# EAGLE design 1 (EAGLE 9.6.2)
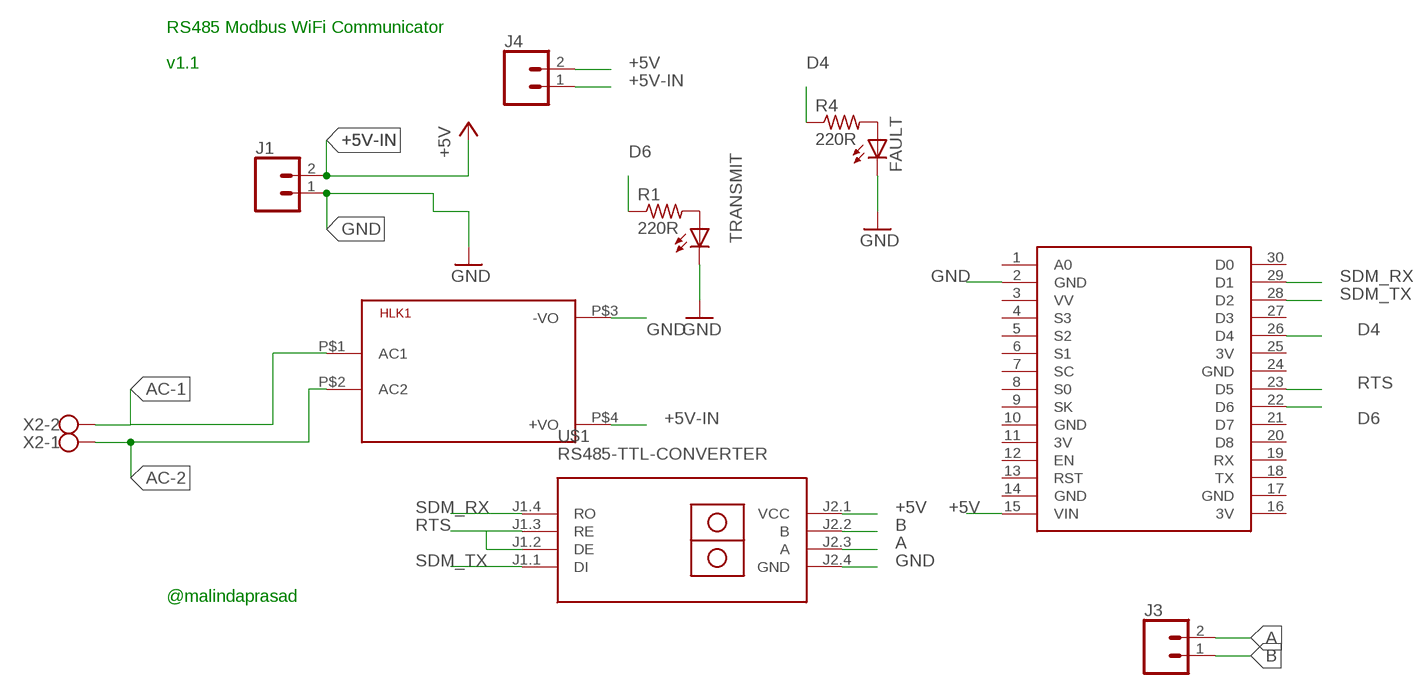
[diagram p0: schematic, sheet 1]

## Parts
FAULT  LED5MM  [LED5MM]
HLK1  HLK-PM013W  [HLK-PM01]
J1  CONN_02  [1X02]
J3  CONN_02  [1X02]
J4  CONN_02  [1X02]
R1  220R  R-US_0207/10  [0207/10]
R4  220R  R-US_0207/10  [0207/10]
TRANSMIT  LED5MM  [LED5MM]
U$1  RS485-TTL-CONVERTER  [RS485-TTL-CONVERTER]
U$2  NODEMCU  [NODEMCU]
X2  W237-102  [W237-102]

## Nets
+5V: J4.2 U$1.J2.1(VCC) U$2.15(VIN)
+5V-IN: HLK1.P$4(+VO) J1.2 J4.1 ; supply symbol labelled +5V
A: J3.2 U$1.J2.3(A)
AC-1: HLK1.P$1(AC1) X2.2
AC-2: HLK1.P$2(AC2) X2.1
B: J3.1 U$1.J2.2(B)
D4: R4.1 U$2.26(D4)
D6: R1.1 U$2.22(D6)
GND: FAULT.K(C) HLK1.P$3(-VO) J1.1 TRANSMIT.K(C) U$1.J2.4(GND) U$2.2(GND)
N$1: R1.2 TRANSMIT.A
N$5: FAULT.A R4.2
RTS: U$1.J1.2(DE) U$1.J1.3(RE) U$2.23(D5)
SDM_RX: U$1.J1.4(RO) U$2.29(D1)
SDM_TX: U$1.J1.1(DI) U$2.28(D2)
Unconnected: U$2.1(A0) U$2.3(VV) U$2.4(S3) U$2.5(S2) U$2.6(S1) U$2.7(SC) U$2.8(S0) U$2.9(SK) U$2.12(EN) U$2.13(RST) U$2.18(TX) U$2.19(RX) U$2.20(D8) U$2.21(D7) U$2.27(D3) U$2.30(D0)

## Notes on the sheet
- RS485 Modbus WiFi Communicator
- v1.1
- @malindaprasad

## Power pins joined to a net without a drawn wire
3V: U$2.11(3V) U$2.16(3V) U$2.25(3V)
GND: U$2.10(GND) U$2.14(GND) U$2.17(GND) U$2.24(GND)

## Library data of the parts
FAULT TRANSMIT = adafruit:LED: LED OSRAM: - CHIPLED LG R971, LG N971, LY N971, LG Q971, LY Q971, LO R971, LY R971 LH N974, LH R974 LS Q976, LO Q976, LY Q976 LO Q996 - Hyper CHIPLED LW Q18S LB Q993, LB Q99A, LB R99A - SideLED LS A670, LO A670, LY A670, LG A670, LP A670 LB A673, LV A673, LT A673, LW A673 LH A674 LY A675 LS A676, LA A676, LO A676, LY A676, LW A676 LS A679, LY A679, LG A679 - Hyper Micro SIDELED® LS Y876, LA Y876, LO Y876, LY Y876 LT Y87S - SmartLED LW L88C, LW L88S LB L89C, LB L89S, LG L890 LS L89K, LO L89K, LY L89K LS L896, LA L896, LO L896, LY L896 - TOPLED LS T670, LO T670, LY T670, LG T670, LP T670 LSG T670, LSP T670, LSY T670, LOP T670, LYG T670 LG T671, LOG T671, LSG T671 LB T673, LV T673, LT T673, LW T673 LH T674 LS T676, LA T676, LO T676, LY T676, LB T676, LH T676, LSB T676, LW T676 LB T67C, LV T67C, LT T67C, LS T67K, LO T67K, LY T67K, LW E67C LS E67B, LA E67B, LO E67B, LY E67B, LB E67C, LV E67C, LT E67C LW T67C LS T679, LY T679, LG T679 LS T770, LO T770, LY T770, LG T770, LP T770 LB T773, LV T773, LT T773, LW T773 LH T774 LS E675, LA E675, LY E675, LS T675 LS T776, LA T776, LO T776, LY T776, LB T776 LHGB T686 LT T68C, LB T68C - Hyper Mini TOPLED® LB M676 - Mini TOPLED Santana® LG M470 LS M47K, LO M47K, LY M47K Source: http://www.osram.convergy.de/
HLK1 = HLK-PM01:HLK-PM01: Hi-Link Power Supply HLK-PM01 3W Author: Ahmed Said <https://github.com/AhmedSaid/EAGLELibraries>
J1 J3 J4 = SparkFun-Connectors:CONN_02: Multi connection point. Often used as Generic Header-pin footprint for 0.1 inch spaced/style header connections On any of the 0.1 inch spaced packages, you can populate with these: Break Away Headers - Straight <https://www.sparkfun.com/products/116> (PRT-00116) Break Away Male Headers - Right Angle <https://www.sparkfun.com/products/553> (PRT-00553) Female Headers <https://www.sparkfun.com/products/115> (PRT-00115) Break Away Headers - Machine Pin <https://www.sparkfun.com/products/117> (PRT-00117) Break Away Female Headers - Swiss Machine Pin <https://www.sparkfun.com/products/743> (PRT-00743) For SCREWTERMINALS and SPRING TERMINALS visit here: Screw Terimnals on SparkFun.com <https://www.sparkfun.com/search/results?term=Screw+Terminals> (5mm/3.5mm/2.54mm spacing) This device is also useful as a general connection point to wire up your design to another part of your project. Our various solder wires solder well into these plated through hole pads. Hook-Up Wire - Assortment (Stranded, 22 AWG) <https://www.sparkfun.com/products/11375> (PRT-11375) Hook-Up Wire - Assortment (Solid Core, 22 AWG) <https://www.sparkfun.com/products/11367> (PRT-11367) View the entire wire category on our website here <https://www.sparkfun.com/categories/141> Special notes: Molex polarized connector foot print use with: PRT-08233 with associated crimp pins and housings. 2.54_SCREWTERM for use with PRT-10571. 3.5mm Screw Terminal footprints for PRT-08084 5mm Screw Terminal footprints for use with PRT-08432
R1 R4 = rcl:R-US_: RESISTOR, American symbol; SPICEPREFIX: R
U$1 = diy-modules:RS485-TTL-CONVERTER: RS485 to TTL converter based on MAX485 chip
U$2 = nodemcu:NODEMCU
X2 = con-wago-500:W237-102: WAGO SCREW CLAMP; MPN: 237-102; OC_FARNELL: unknown; OC_NEWARK: 70K9898

## Net classes
0 default: width 0.254 mm, drill 0.356 mm, clearance 0.254 mm

## Board
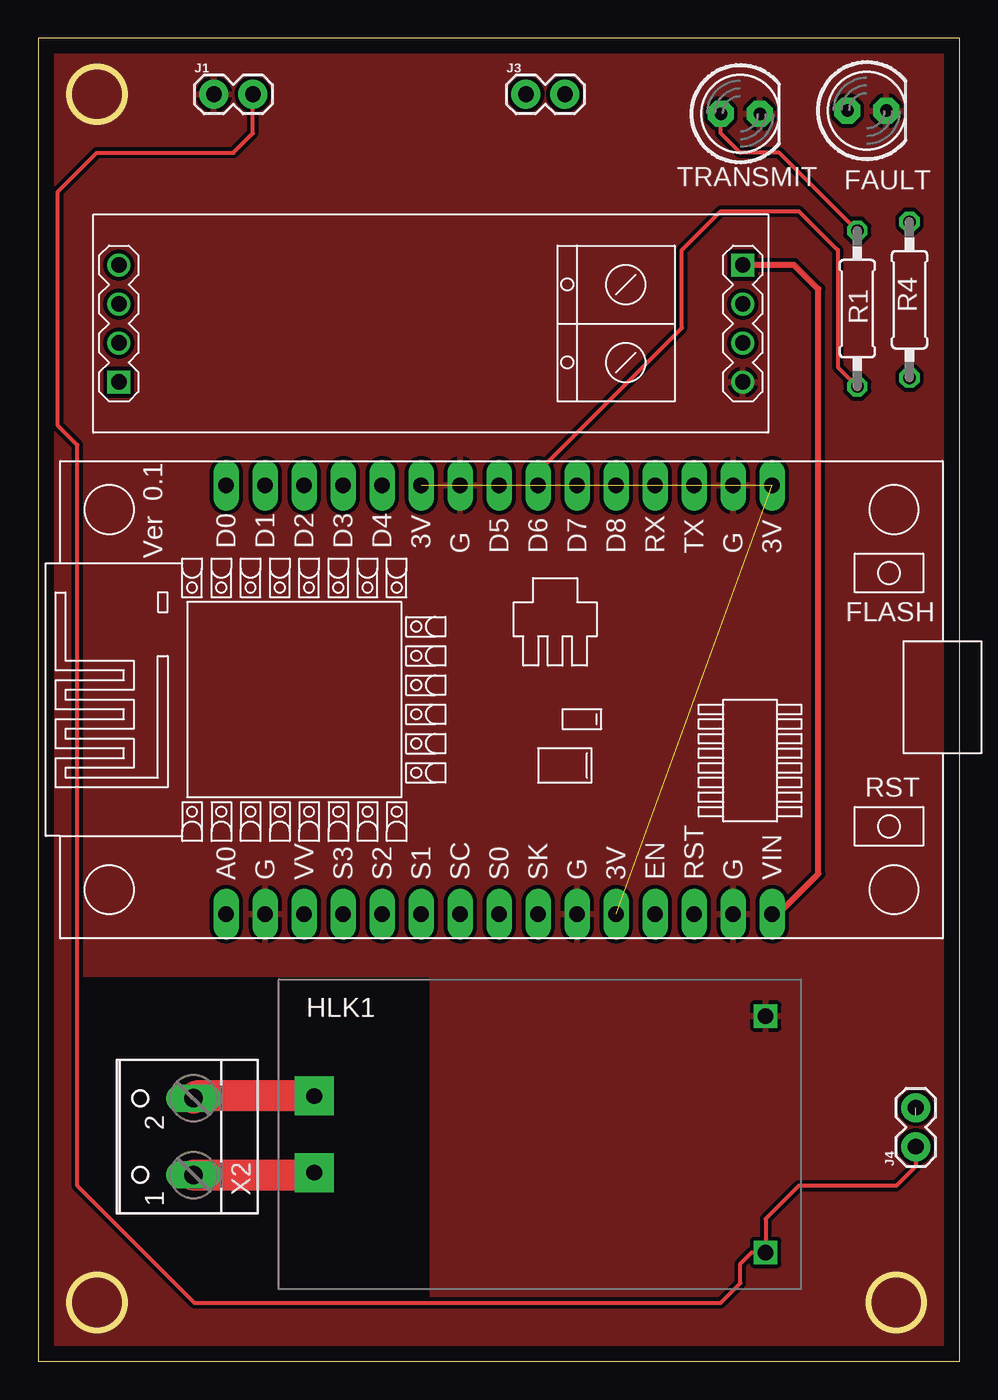
[diagram p1: board, top side]
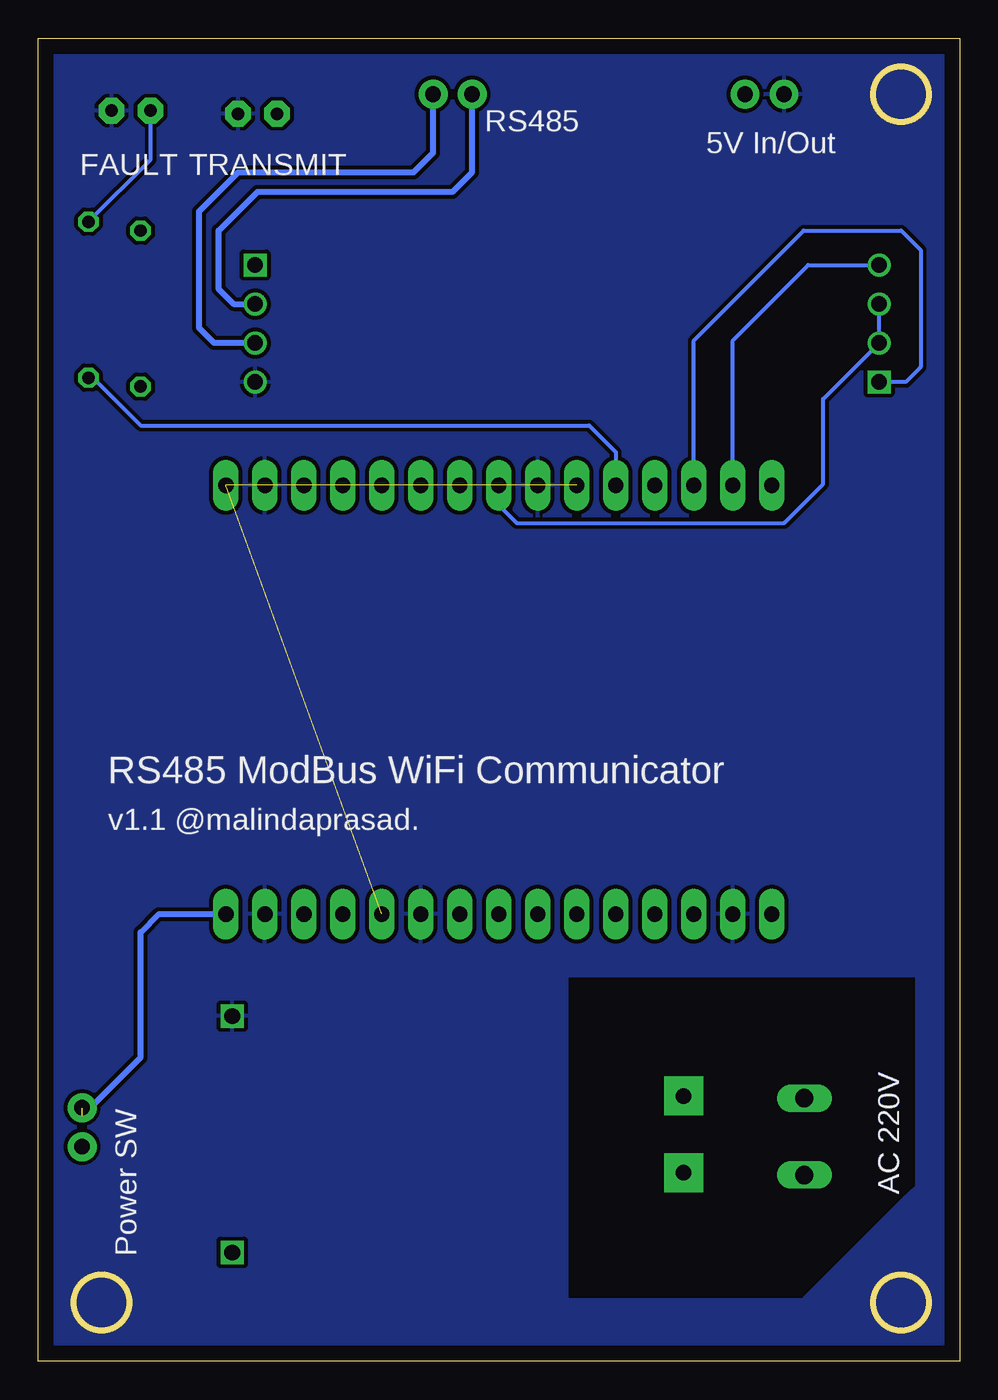
[diagram p2: board, bottom side, seen from below]

Size 60 x 86.19 mm. Coordinates in mm from the lower left corner, seen from the top.
Outline: 0,0 60,0 60,86.19 0,86.19 0,0
Copper layers (1*16): Top 0.035mm / dielectric 1.5mm / Bottom 0.035mm
Design rules "default *": minimum track width 6mil, minimum drill 0.35mm, track to track 6mil, track to pad 6mil, pad to pad 6mil, via to via 6mil, smd to smd 6mil, copper to edge 40mil, drill to drill 6mil, minimum pad ring 10mil, minimum via ring 8mil, stop-mask expansion 4mil, vias tented up to drill 0mil, thermal gap 10mil
Milling: area 2,80.8 to 5.6,84.3; area 54.1,2 to 57.7,5.6; area 2,2 to 5.6,5.6

### Footprints (pad centres in the part's own frame; a part is rotated, then mirrored left to right if it is on the bottom)
LED5MM = drill 0.813 pad 1.676 octagon: A -1.27,0; K 1.27,0
HLK-PM01 = drill 1.016 pad 2.54 square: P$1 -14.7,2.5; P$2 -14.7,-2.5 | drill 1.016 square: P$3 14.7,7.7; P$4 14.7,-7.7
1X02 = drill 1.016 pad 1.88: 1 0,0; 2 2.54,0
0207/10 = drill 0.813 octagon: 1 -5.08,0; 2 5.08,0
RS485-TTL-CONVERTER = drill 1 square: J1.1 -20.32,-3.81; J2.1 20.32,3.81 | drill 1: J1.2 -20.32,-1.27; J1.3 -20.32,1.27; J1.4 -20.32,3.81; J2.2 20.32,1.27; J2.3 20.32,-1.27; J2.4 20.32,-3.81
NODEMCU = drill 1 pad 1.676 long: 1 -13.97,17.78; 2 -13.97,15.24; 3 -13.97,12.7; 4 -13.97,10.16; 5 -13.97,7.62; 6 -13.97,5.08; 7 -13.97,2.54; 8 -13.97,0; 9 -13.97,-2.54; 10 -13.97,-5.08; 11 -13.97,-7.62; 12 -13.97,-10.16; 13 -13.97,-12.7; 14 -13.97,-15.24; 15 -13.97,-17.78; 16 13.97,-17.78; 17 13.97,-15.24; 18 13.97,-12.7; 19 13.97,-10.16; 20 13.97,-7.62; 21 13.97,-5.08; 22 13.97,-2.54; 23 13.97,0; 24 13.97,2.54; 25 13.97,5.08; 26 13.97,7.62; 27 13.97,10.16; 28 13.97,12.7; 29 13.97,15.24; 30 13.97,17.78
W237-102 = drill 1.194 long: 1 -2.5,-1.27; 2 2.5,-1.27

### Placement (x,y rotation side)
FAULT  53.96,81.48 0 top
HLK1  32.67,14.78 0 top
J1  11.43,82.55 0 top
J3  31.75,82.55 0 top
J4  57.15,13.97 90 top
R1  53.34,68.58 90 top
R4  56.74,69.16 90 top
TRANSMIT  45.72,81.28 0 top
U$1  25.56,67.61 0 top
U$2  30.01,43.1 90 top
X2  8.84,14.63 90 top

### Tracks (layer width: path | path; a pad name or v marks a point on that pad's centre or on a via)
3V  (2 unrouted)
+5V  (1 unrouted)
  Top 0.406: U$2.15 47.98,28.93 50.8,31.75 50.8,69.85 49.23,71.42 U$1.J2.1
  Bottom 0.406: 57.15,15.97 53.34,19.78 53.34,27.94 52.15,29.13 U$2.15
+5V-IN
  Top 0.254: J1.2 13.97,80.01 12.7,78.74 3.81,78.74 1.27,76.2 1.27,60.96 2.54,59.69 2.54,11.43 10.16,3.81 44.45,3.81 45.72,5.08 45.72,6.35 46.45,7.08 HLK1.P$4 47.37,9.27 49.53,11.43 55.88,11.43 57.15,12.7 J4.1
A
  Bottom 0.406: U$1.J2.3 48.56,66.34 49.53,67.31 49.53,74.93 46.99,77.47 35.56,77.47 34.29,78.74 J3.2
AC-1
  Top 2.032: HLK1.P$1 10.26,17.28 X2.2
AC-2
  Top 2.032: X2.1 17.82,12.13 HLK1.P$2
B
  Bottom 0.406: U$1.J2.2 47.29,68.88 48.26,69.85 48.26,73.66 45.72,76.2 33.02,76.2 31.75,77.47 J3.1
D4
  Bottom 0.254: R4.1 56.46,64.08 53.34,60.96 24.13,60.96 22.39,59.22 U$2.26
D6
  Top 0.254: U$2.22 32.55,57.95 41.91,67.31 41.91,72.39 44.45,74.93 49.53,74.93 52.07,72.39 52.07,64.77 R1.1
GND
  pour Bottom: 0,86.36 59.69,86.36 59.69,0 0,0
  pour Top (isolate 0.254): 0,86.36 59.69,86.36 59.69,0 0,0
  pour Top: 0,86.36 59.69,86.36 59.69,0 0,0
N$1
  Top 0.254: R1.2 48.26,78.74 45.72,78.74 44.45,80.01 TRANSMIT.A
N$2
  cutout Top: 3,24.94 3,11.68 10.29,4.19 25.4,4.19 25.4,24.94
N$3
  cutout Bottom: 3,24.94 25.4,24.94 25.4,4.19 10.29,4.19 3.81,10.67 3,11.43
N$5
  Bottom 0.254: R4.2 52.69,78.29 FAULT.A
RTS
  Bottom 0.254: U$1.J1.3 U$1.J1.2 8.89,62.69 8.89,57.15 11.43,54.61 28.84,54.61 30.01,55.78 U$2.23
SDM_RX
  Bottom 0.254: U$2.29 14.77,66.51 9.86,71.42 U$1.J1.4
SDM_TX
  Bottom 0.254: U$2.28 17.31,66.51 10.16,73.66 3.81,73.66 2.54,72.39 2.54,64.77 3.51,63.8 U$1.J1.1

### Text on the board
bNames: RS485 | 5V In/Out | TRANSMIT | FAULT | RS485 ModBus WiFi Communicator | v1.1 @malindaprasad. | AC 220V | Power SW
tValues: HIGH VOLTAGE